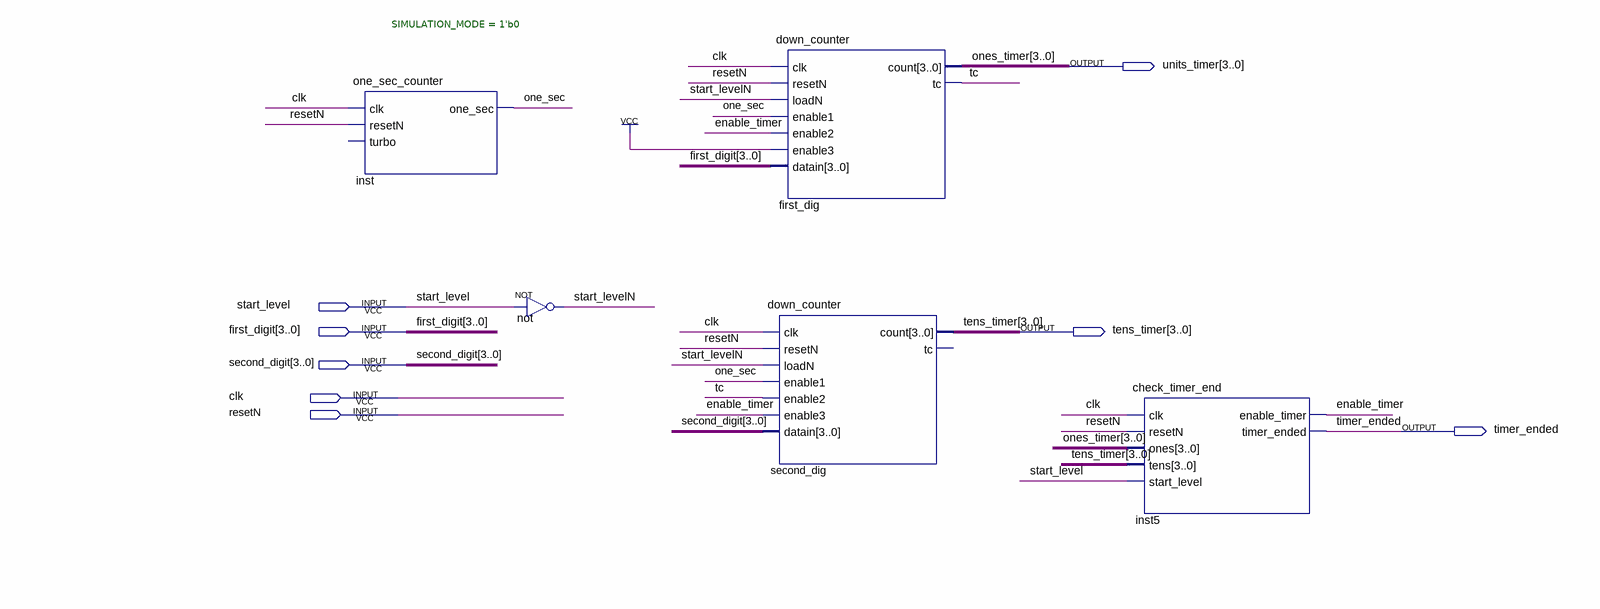
[diagram p0: schematic sheet]
// Quartus schematic Timer_Block.bdf as structural Verilog: 5 symbols, 8 pins
module Timer_Block (
  input  start_level,
  input  [3:0] first_digit,
  input  [3:0] second_digit,
  input  clk,
  input  resetN,
  output [3:0] units_timer,
  output [3:0] tens_timer,
  output timer_ended
);

  wire enable_timer, one_sec, start_levelN, tc;

  one_sec_counter #(.SIMULATION_MODE(1'b0)) inst (.clk(clk), .resetN(resetN), .one_sec(one_sec));  // open: turbo
  not \not  (start_levelN, start_level);
  down_counter first_dig (
    .clk(clk), .resetN(resetN), .loadN(start_levelN), .enable1(one_sec), .enable2(enable_timer),
    .enable3(1'b1), .datain(first_digit), .count(units_timer), .tc(tc));
  down_counter second_dig (
    .clk(clk), .resetN(resetN), .loadN(start_levelN), .enable1(one_sec), .enable2(tc),
    .enable3(enable_timer), .datain(second_digit), .count(tens_timer));  // open: tc
  check_timer_end inst5 (
    .clk(clk), .resetN(resetN), .ones(units_timer), .tens(tens_timer), .start_level(start_level),
    .enable_timer(enable_timer), .timer_ended(timer_ended));

  // Other names for the same wires on the sheet: ones_timer[3:0] = units_timer
endmodule
